# Altium schematic sheet Connectors.SchDoc
size A
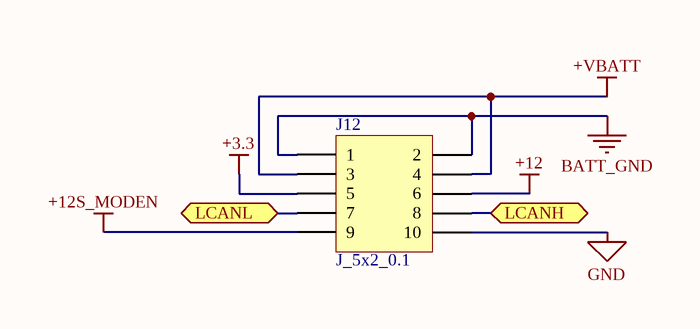
[diagram p0: Connectors.SchDoc]

## Parts
J12  J_5x2_0.1  [10PIN_2_.100IN]

## Ports
LCANH, LCANL

## Nets
+3.3: J12.5
+12: J12.6
+12S_MODEN: J12.9
+VBATT: J12.3 J12.4
BATT_GND: J12.1 J12.2
GND: J12.10
LCANH: J12.8 ; port LCANH
LCANL: J12.7 ; port LCANL

## Library data of the parts
J12 = J_5x2_0.1: 5 x 2 0.1" Header